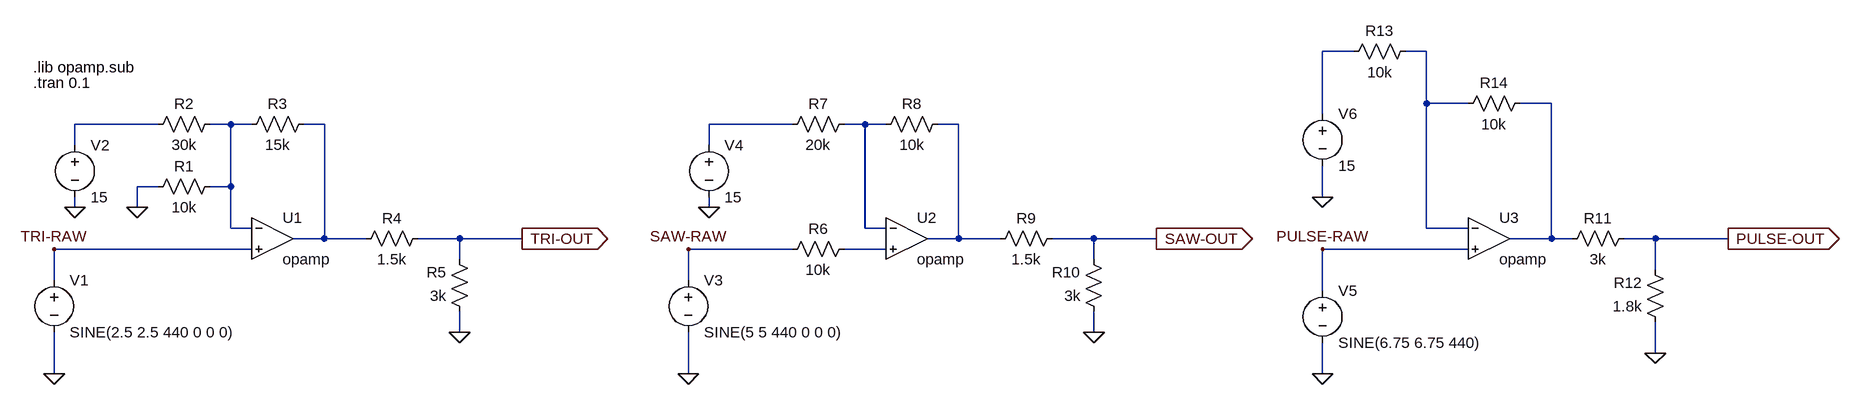
[diagram p0: schematic ltspice-level-shifters.asc]
ltspice-level-shifters.asc, the LTspice schematic file:
Version 4
SHEET 1 2896 680
WIRE 2128 -288 2080 -288
WIRE 2240 -288 2208 -288
WIRE 2240 -208 2240 -288
WIRE 2304 -208 2240 -208
WIRE 2432 -208 2384 -208
WIRE 2080 -192 2080 -288
WIRE 288 -176 160 -176
WIRE 400 -176 368 -176
WIRE 432 -176 400 -176
WIRE 544 -176 512 -176
WIRE 1264 -176 1136 -176
WIRE 1376 -176 1344 -176
WIRE 1408 -176 1376 -176
WIRE 1520 -176 1488 -176
WIRE 160 -144 160 -176
WIRE 1136 -144 1136 -176
WIRE 288 -80 256 -80
WIRE 400 -80 400 -176
WIRE 400 -80 368 -80
WIRE 2080 -64 2080 -112
WIRE 160 -48 160 -64
WIRE 256 -48 256 -80
WIRE 1136 -48 1136 -64
WIRE 400 -16 400 -80
WIRE 432 -16 400 -16
WIRE 1376 -16 1376 -176
WIRE 1408 -16 1376 -16
WIRE 2240 -16 2240 -208
WIRE 2304 -16 2240 -16
WIRE 544 0 544 -176
WIRE 544 0 496 0
WIRE 608 0 544 0
WIRE 752 0 688 0
WIRE 848 0 752 0
WIRE 1520 0 1520 -176
WIRE 1520 0 1472 0
WIRE 1584 0 1520 0
WIRE 1728 0 1664 0
WIRE 1824 0 1728 0
WIRE 2432 0 2432 -208
WIRE 2432 0 2368 0
WIRE 2464 0 2432 0
WIRE 2592 0 2544 0
WIRE 2704 0 2592 0
WIRE 432 16 128 16
WIRE 1264 16 1104 16
WIRE 1408 16 1344 16
WIRE 2304 16 2080 16
WIRE 752 32 752 0
WIRE 1728 32 1728 0
WIRE 2592 48 2592 0
WIRE 128 64 128 16
WIRE 1104 64 1104 16
WIRE 2080 80 2080 16
WIRE 752 144 752 112
WIRE 1728 144 1728 112
WIRE 2592 176 2592 128
WIRE 128 208 128 144
WIRE 1104 208 1104 144
WIRE 2080 208 2080 160
FLAG 128 208 0
FLAG 128 16 TRI-RAW
FLAG 256 -48 0
FLAG 752 144 0
FLAG 160 -48 0
FLAG 848 0 TRI-OUT
IOPIN 848 0 Out
FLAG 1104 208 0
FLAG 1104 16 SAW-RAW
FLAG 1728 144 0
FLAG 1136 -48 0
FLAG 1824 0 SAW-OUT
IOPIN 1824 0 Out
FLAG 2080 208 0
FLAG 2080 16 PULSE-RAW
FLAG 2080 -64 0
FLAG 2592 176 0
FLAG 2704 0 PULSE-OUT
IOPIN 2704 0 Out
SYMBOL voltage 128 48 R0
WINDOW 123 0 0 Left 0
WINDOW 39 0 0 Left 0
SYMATTR InstName V1
SYMATTR Value SINE(2.5 2.5 440 0 0 0)
SYMBOL Opamps\\opamp 464 -64 R0
SYMATTR InstName U1
SYMBOL res 384 -96 R90
WINDOW 0 0 56 VBottom 2
WINDOW 3 32 56 VTop 2
SYMATTR InstName R1
SYMATTR Value 10k
SYMBOL res 384 -192 R90
WINDOW 0 0 56 VBottom 2
WINDOW 3 32 56 VTop 2
SYMATTR InstName R2
SYMATTR Value 30k
SYMBOL res 528 -192 R90
WINDOW 0 0 56 VBottom 2
WINDOW 3 32 56 VTop 2
SYMATTR InstName R3
SYMATTR Value 15k
SYMBOL res 704 -16 R90
WINDOW 0 0 56 VBottom 2
WINDOW 3 32 56 VTop 2
SYMATTR InstName R4
SYMATTR Value 1.5k
SYMBOL res 768 128 R180
WINDOW 0 36 76 Left 2
WINDOW 3 36 40 Left 2
SYMATTR InstName R5
SYMATTR Value 3k
SYMBOL voltage 160 -160 R0
WINDOW 123 0 0 Left 0
WINDOW 39 0 0 Left 0
SYMATTR InstName V2
SYMATTR Value 15
SYMBOL voltage 1104 48 R0
WINDOW 123 0 0 Left 0
WINDOW 39 0 0 Left 0
SYMATTR InstName V3
SYMATTR Value SINE(5 5 440 0 0 0)
SYMBOL Opamps\\opamp 1440 -64 R0
SYMATTR InstName U2
SYMBOL res 1360 -192 R90
WINDOW 0 0 56 VBottom 2
WINDOW 3 32 56 VTop 2
SYMATTR InstName R7
SYMATTR Value 20k
SYMBOL res 1504 -192 R90
WINDOW 0 0 56 VBottom 2
WINDOW 3 32 56 VTop 2
SYMATTR InstName R8
SYMATTR Value 10k
SYMBOL res 1680 -16 R90
WINDOW 0 0 56 VBottom 2
WINDOW 3 32 56 VTop 2
SYMATTR InstName R9
SYMATTR Value 1.5k
SYMBOL res 1744 128 R180
WINDOW 0 36 76 Left 2
WINDOW 3 36 40 Left 2
SYMATTR InstName R10
SYMATTR Value 3k
SYMBOL voltage 1136 -160 R0
WINDOW 123 0 0 Left 0
WINDOW 39 0 0 Left 0
SYMATTR InstName V4
SYMATTR Value 15
SYMBOL res 1360 0 R90
WINDOW 0 0 56 VBottom 2
WINDOW 3 32 56 VTop 2
SYMATTR InstName R6
SYMATTR Value 10k
SYMBOL voltage 2080 64 R0
WINDOW 123 0 0 Left 0
WINDOW 39 0 0 Left 0
SYMATTR InstName V5
SYMATTR Value SINE(6.75 6.75 440)
SYMBOL Opamps\\opamp 2336 -64 R0
SYMATTR InstName U3
SYMBOL voltage 2080 -208 R0
WINDOW 123 0 0 Left 0
WINDOW 39 0 0 Left 0
SYMATTR InstName V6
SYMATTR Value 15
SYMBOL res 2560 -16 R90
WINDOW 0 0 56 VBottom 2
WINDOW 3 32 56 VTop 2
SYMATTR InstName R11
SYMATTR Value 3k
SYMBOL res 2608 144 R180
WINDOW 0 36 76 Left 2
WINDOW 3 36 40 Left 2
SYMATTR InstName R12
SYMATTR Value 1.8k
SYMBOL res 2224 -304 R90
WINDOW 0 0 56 VBottom 2
WINDOW 3 32 56 VTop 2
SYMATTR InstName R13
SYMATTR Value 10k
SYMBOL res 2400 -224 R90
WINDOW 0 0 56 VBottom 2
WINDOW 3 32 56 VTop 2
SYMATTR InstName R14
SYMATTR Value 10k
TEXT 96 -240 Left 2 !.tran 0.1
TEXT 96 -264 Left 2 !.lib opamp.sub

The netlist it stands for:
* ltspice-level-shifters.asc
V1 TRI-RAW 0 SINE(2.5 2.5 440 0 0 0)
XU1 N005 TRI-RAW N006 opamp Aol=100K GBW=10Meg  ; pins invin noninvin out
R1 N005 0 10k
R2 N005 N004 30k
R3 N006 N005 15k
R4 TRI-OUT N006 1.5k
R5 0 TRI-OUT 3k
V2 N004 0 15
V3 SAW-RAW 0 SINE(5 5 440 0 0 0)
XU2 N008 N010 N009 opamp Aol=100K GBW=10Meg  ; pins invin noninvin out
R7 N008 N007 20k
R8 N009 N008 10k
R9 SAW-OUT N009 1.5k
R10 0 SAW-OUT 3k
V4 N007 0 15
R6 N010 SAW-RAW 10k
V5 PULSE-RAW 0 SINE(6.75 6.75 440)
XU3 N002 PULSE-RAW N003 opamp Aol=100K GBW=10Meg  ; pins invin noninvin out
V6 N001 0 15
R11 PULSE-OUT N003 3k
R12 0 PULSE-OUT 1.8k
R13 N002 N001 10k
R14 N003 N002 10k
.tran 0.1
.lib opamp.sub
.backanno
.end